# Altium project QCopterRC.PrjPCB
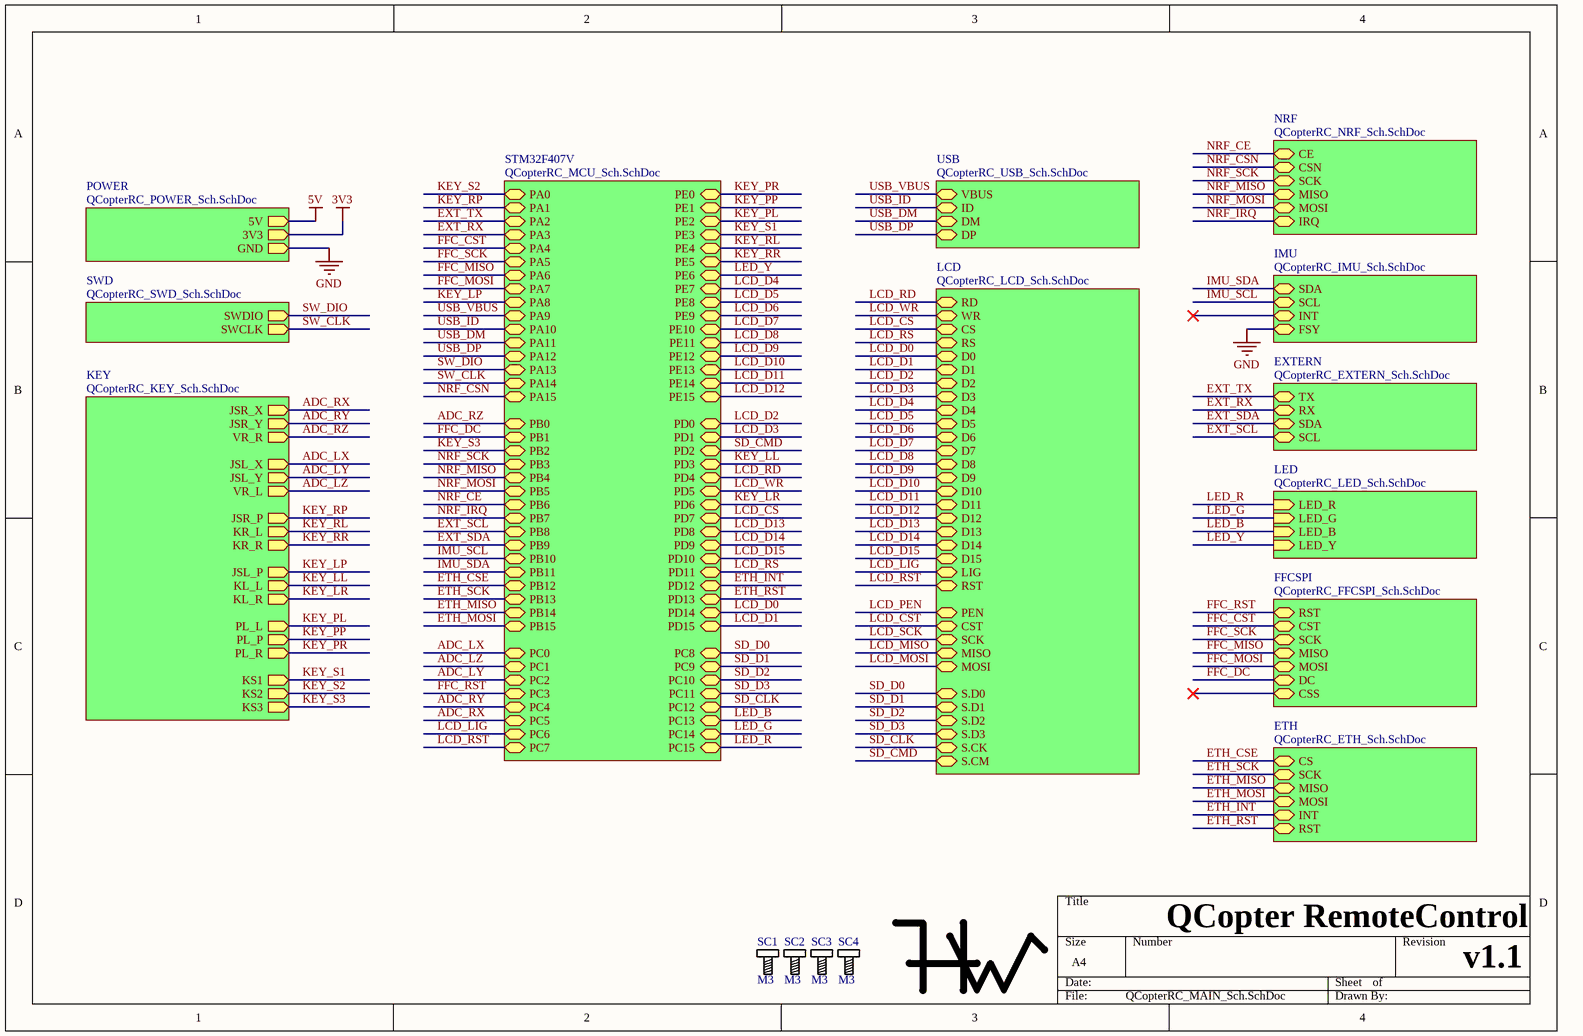
[diagram p0: QCopterRC_MAIN_Sch.SchDoc]
13 sheets, 122 parts. Net scope: hierarchical (ports join the sheet entries above them; power ports are global).
Board file: QCopterRC__Pcb.PcbDoc
Sheets:
  QCopterRC_MAIN_Sch.SchDoc
    POWER = QCopterRC_POWER_Sch.SchDoc
    SWD = QCopterRC_SWD_Sch.SchDoc
    LED = QCopterRC_LED_Sch.SchDoc
    STM32F407V = QCopterRC_MCU_Sch.SchDoc
    LCD = QCopterRC_LCD_Sch.SchDoc
    USB = QCopterRC_USB_Sch.SchDoc
    NRF = QCopterRC_NRF_Sch.SchDoc
    IMU = QCopterRC_IMU_Sch.SchDoc
    EXTERN = QCopterRC_EXTERN_Sch.SchDoc
    ETH = QCopterRC_ETH_Sch.SchDoc
    KEY = QCopterRC_KEY_Sch.SchDoc
    FFCSPI = QCopterRC_FFCSPI_Sch.SchDoc

## Sheet QCopterRC_MAIN_Sch.SchDoc
size A4

### Parts
HW  HW  [Logo_HW]  (value not drawn)
SC1  M3  [SCRREW_M3]
SC2  M3  [SCRREW_M3]
SC3  M3  [SCRREW_M3]
SC4  M3  [SCRREW_M3]

### Sub-sheets
ETH = QCopterRC_ETH_Sch.SchDoc: MISO, MOSI, SCK, CS, INT, RST
EXTERN = QCopterRC_EXTERN_Sch.SchDoc: SDA, SCL, TX, RX
FFCSPI = QCopterRC_FFCSPI_Sch.SchDoc: MISO, CST, MOSI, SCK, RST, DC, CSS
IMU = QCopterRC_IMU_Sch.SchDoc: SCL, SDA, FSY, INT
KEY = QCopterRC_KEY_Sch.SchDoc: JSR_Y (out), JSR_X (out), JSL_X (out), JSL_Y (out), VR_R (out), VR_L (out), KL_L (out), KL_R (out), KR_L (out), KR_R (out), JSL_P (out), PL_R (out), PL_L (out), JSR_P (out), KS1 (out), KS2 (out), KS3 (out), PL_P (out)
LCD = QCopterRC_LCD_Sch.SchDoc: RS, CS, WR, RD, RST, D0, D1, D2, D3, D4, D5, D6, D7, D8, D9, D10, D11, D12, D13, D14, D15, PEN, S.D0, S.CK, S.CM, S.D1, S.D2, S.D3, LIG, CST, SCK, MISO, MOSI
LED = QCopterRC_LED_Sch.SchDoc: LED_R (in), LED_G (in), LED_B (in), LED_Y (in)
NRF = QCopterRC_NRF_Sch.SchDoc: MISO, MOSI, SCK, CSN, CE, IRQ
POWER = QCopterRC_POWER_Sch.SchDoc: 3V3 (out), 5V (out), GND (out)
STM32F407V = QCopterRC_MCU_Sch.SchDoc: PA0, PA1, PA2, PA3, PA4, PA5, PA6, PA7, PA8, PA9, PA10, PA11, PA12, PA13, PA14, PA15, PB0, PB1, PB2, PB3, PB4, PB5, PB6, PB7, PB8, PB9, PB10, PB11, PB12, PB13, PB14, PB15, PC0, PC1, PC2, PC3, PC4, PC5, PC6, PC7, PC8, PC9, PC10, PC11, PC12, PC13, PC14, PC15, PD0, PD1, PD2, PD3, PD4, PD5, PD6, PD7, PD8, PD9, PD10, PD11, PD12, PD13, PD14, PD15, PE0, PE1, PE2, PE3, PE4, PE5, PE6, PE7, PE8, PE9, PE10, PE11, PE12, PE13, PE14, PE15
SWD = QCopterRC_SWD_Sch.SchDoc: SWDIO (out), SWCLK (out)
USB = QCopterRC_USB_Sch.SchDoc: VBUS, ID, DM, DP

### Nets
GND: sheet POWER/GND, sheet IMU/FSY
ADC_LX: sheet STM32F407V/PC0, sheet KEY/JSL_X
ADC_LY: sheet STM32F407V/PC2, sheet KEY/JSL_Y
ADC_LZ: sheet STM32F407V/PC1, sheet KEY/VR_L
ADC_RX: sheet STM32F407V/PC5, sheet KEY/JSR_X
ADC_RY: sheet STM32F407V/PC4, sheet KEY/JSR_Y
ADC_RZ: sheet STM32F407V/PB0, sheet KEY/VR_R
ETH_CSE: sheet STM32F407V/PB12, sheet ETH/CS
ETH_INT: sheet STM32F407V/PD12, sheet ETH/INT
ETH_MISO: sheet STM32F407V/PB14, sheet ETH/MISO
ETH_MOSI: sheet STM32F407V/PB15, sheet ETH/MOSI
ETH_RST: sheet STM32F407V/PD13, sheet ETH/RST
ETH_SCK: sheet STM32F407V/PB13, sheet ETH/SCK
EXT_RX: sheet STM32F407V/PA3, sheet EXTERN/RX
EXT_SCL: sheet STM32F407V/PB8, sheet EXTERN/SCL
EXT_SDA: sheet STM32F407V/PB9, sheet EXTERN/SDA
EXT_TX: sheet STM32F407V/PA2, sheet EXTERN/TX
FFC_CST: sheet STM32F407V/PA4, sheet FFCSPI/CST
FFC_DC: sheet STM32F407V/PB1, sheet FFCSPI/DC
FFC_MISO: sheet STM32F407V/PA6, sheet FFCSPI/MISO
FFC_MOSI: sheet STM32F407V/PA7, sheet FFCSPI/MOSI
FFC_RST: sheet STM32F407V/PC3, sheet FFCSPI/RST
FFC_SCK: sheet STM32F407V/PA5, sheet FFCSPI/SCK
IMU_SCL: sheet STM32F407V/PB10, sheet IMU/SCL
IMU_SDA: sheet STM32F407V/PB11, sheet IMU/SDA
KEY_LL: sheet STM32F407V/PD3, sheet KEY/KL_L
KEY_LP: sheet STM32F407V/PA8, sheet KEY/JSL_P
KEY_LR: sheet STM32F407V/PD6, sheet KEY/KL_R
KEY_PL: sheet STM32F407V/PE2, sheet KEY/PL_L
KEY_PP: sheet STM32F407V/PE1, sheet KEY/PL_P
KEY_PR: sheet STM32F407V/PE0, sheet KEY/PL_R
KEY_RL: sheet STM32F407V/PE4, sheet KEY/KR_L
KEY_RP: sheet STM32F407V/PA1, sheet KEY/JSR_P
KEY_RR: sheet STM32F407V/PE5, sheet KEY/KR_R
KEY_S1: sheet STM32F407V/PE3, sheet KEY/KS1
KEY_S2: sheet STM32F407V/PA0, sheet KEY/KS2
KEY_S3: sheet STM32F407V/PB2, sheet KEY/KS3
LCD_CS: sheet STM32F407V/PD7, sheet LCD/CS
LCD_CST: sheet LCD/CST
LCD_D0: sheet STM32F407V/PD14, sheet LCD/D0
LCD_D1: sheet STM32F407V/PD15, sheet LCD/D1
LCD_D2: sheet STM32F407V/PD0, sheet LCD/D2
LCD_D3: sheet STM32F407V/PD1, sheet LCD/D3
LCD_D4: sheet STM32F407V/PE7, sheet LCD/D4
LCD_D5: sheet STM32F407V/PE8, sheet LCD/D5
LCD_D6: sheet STM32F407V/PE9, sheet LCD/D6
LCD_D7: sheet STM32F407V/PE10, sheet LCD/D7
LCD_D8: sheet STM32F407V/PE11, sheet LCD/D8
LCD_D9: sheet STM32F407V/PE12, sheet LCD/D9
LCD_D10: sheet STM32F407V/PE13, sheet LCD/D10
LCD_D11: sheet STM32F407V/PE14, sheet LCD/D11
LCD_D12: sheet STM32F407V/PE15, sheet LCD/D12
LCD_D13: sheet STM32F407V/PD8, sheet LCD/D13
LCD_D14: sheet STM32F407V/PD9, sheet LCD/D14
LCD_D15: sheet STM32F407V/PD10, sheet LCD/D15
LCD_LIG: sheet STM32F407V/PC6, sheet LCD/LIG
LCD_MISO: sheet LCD/MISO
LCD_MOSI: sheet LCD/MOSI
LCD_PEN: sheet LCD/PEN
LCD_RD: sheet STM32F407V/PD4, sheet LCD/RD
LCD_RS: sheet STM32F407V/PD11, sheet LCD/RS
LCD_RST: sheet STM32F407V/PC7, sheet LCD/RST
LCD_SCK: sheet LCD/SCK
LCD_WR: sheet STM32F407V/PD5, sheet LCD/WR
LED_B: sheet LED/LED_B, sheet STM32F407V/PC13
LED_G: sheet LED/LED_G, sheet STM32F407V/PC14
LED_R: sheet LED/LED_R, sheet STM32F407V/PC15
LED_Y: sheet LED/LED_Y, sheet STM32F407V/PE6
NRF_CE: sheet STM32F407V/PB6, sheet NRF/CE
NRF_CSN: sheet STM32F407V/PA15, sheet NRF/CSN
NRF_IRQ: sheet STM32F407V/PB7, sheet NRF/IRQ
NRF_MISO: sheet STM32F407V/PB4, sheet NRF/MISO
NRF_MOSI: sheet STM32F407V/PB5, sheet NRF/MOSI
NRF_SCK: sheet STM32F407V/PB3, sheet NRF/SCK
SD_CLK: sheet STM32F407V/PC12, sheet LCD/S.CK
SD_CMD: sheet STM32F407V/PD2, sheet LCD/S.CM
SD_D0: sheet STM32F407V/PC8, sheet LCD/S.D0
SD_D1: sheet STM32F407V/PC9, sheet LCD/S.D1
SD_D2: sheet STM32F407V/PC10, sheet LCD/S.D2
SD_D3: sheet STM32F407V/PC11, sheet LCD/S.D3
SW_CLK: sheet SWD/SWCLK, sheet STM32F407V/PA14
SW_DIO: sheet SWD/SWDIO, sheet STM32F407V/PA13
USB_DM: sheet STM32F407V/PA11, sheet USB/DM
USB_DP: sheet STM32F407V/PA12, sheet USB/DP
USB_ID: sheet STM32F407V/PA10, sheet USB/ID
USB_VBUS: sheet STM32F407V/PA9, sheet USB/VBUS

### Notes on the sheet
- QCopter RemoteControl
- v1.1

### Library data of the parts
HW = HW: Logo
SC1-SC4 = Screw_M3: Screw

## Sheet QCopterRC_POWER_Sch.SchDoc
size A4
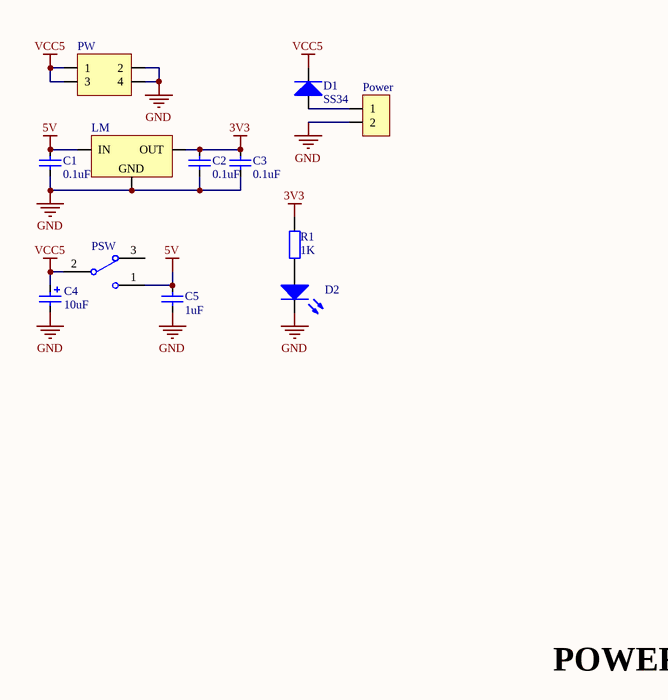
[diagram p1: QCopterRC_POWER_Sch.SchDoc]

### Parts
C1  value 0.1uF  [CAP_0603]  (hidden comment: Cap_0603)
C2  value 0.1uF  [CAP_0603]  (hidden comment: Cap_0603)
C3  value 0.1uF  [CAP_0603]  (hidden comment: Cap_0603)
C4  value 10uF  [CAP_TAN_B1210]  (hidden comment: Cap_Tan_1210)
C5  value 1uF  [CAP_0603]  (hidden comment: Cap_0603)
D1  SMA: SS34  [DO-214AC]  (hidden comment: Diode_SMA)
D2  LED_0603_WHITE  [LED_0603_WHITE]  (value not drawn)
LM  LM1117  [SOT223]  (value not drawn)
Power  HDR1X2_90_2.54  [HDR1X2_90_2.54]  (value not drawn)
PSW  SW_SPDT_4.3X8.6_D90  [SW_SPDT_4.3X8.6_D90]  (value not drawn)
PW  HDR2X2_90_2.54  [HDR2X2_90_2.54]  (value not drawn)
R1  value 1K  [RES_0603]  (hidden comment: Res_0603)

### Nets
3V3: C2.2 C3.2 LM.2(OUT) R1.2
5V: C1.1 C5.2 LM.3(IN) PSW.1
GND: C1.2 C2.1 C3.1 C4.2 C5.1 D2.2(K) LM.1(GND) Power.2 PW.2 PW.4
VCC5: C4.1 D1.2(K) PSW.2 PW.1 PW.3
NetD1_1: D1.1(A) Power.1
NetD2_1: D2.1(A) R1.1

Not connected (* = marked no-connect by the designer): PSW 3

### Notes on the sheet
- POWER

### Library data of the parts
C1-C3 C5 = Cap_0603: Capacitor
C4 = Cap_Tan_1210: Capacitor
D1 = Diode_SMA: Diode
D2 = LED_0603_WHITE: LED
LM = LM1117: Power
Power = HDR1X2_90_2.54: Header
PSW = SW_SPDT_4.3X8.6_D90: Switch
PW = HDR2X2_90_2.54: Header
R1 = Res_0603: Resistor

## Sheet QCopterRC_SWD_Sch.SchDoc
size A4
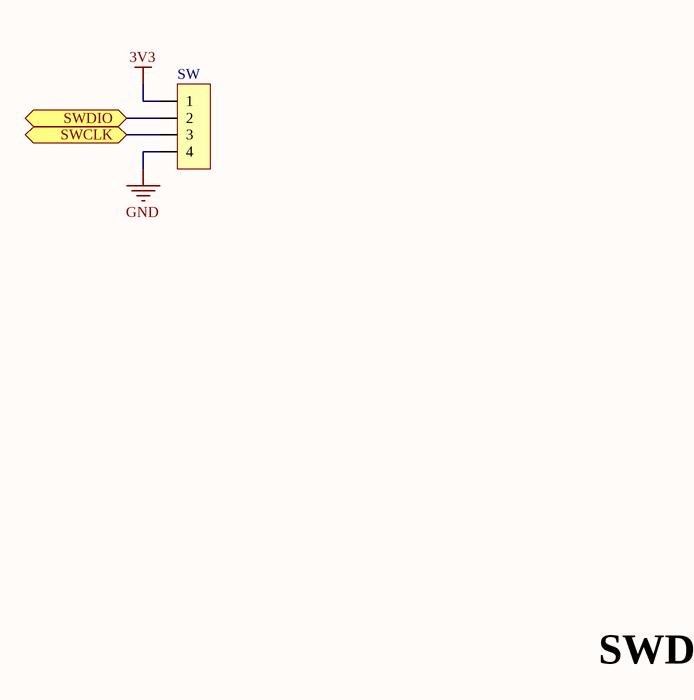
[diagram p2: QCopterRC_SWD_Sch.SchDoc]

### Parts
SW  HDR1X4_90F_2.54  [HDR1X4_90F_2.54]  (value not drawn)

### Ports
SWCLK, SWDIO

### Nets
3V3: SW.1
GND: SW.4
SW_CLK: SW.3 ; port SWCLK
SW_DIO: SW.2 ; port SWDIO

### Notes on the sheet
- SWD

### Library data of the parts
SW = HDR1X4_90F_2.54: Header

## Sheet QCopterRC_LED_Sch.SchDoc
size A4
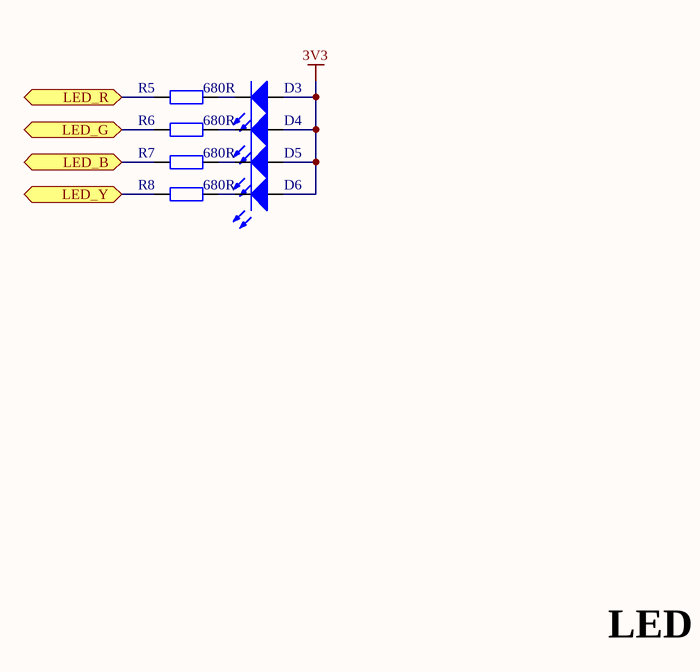
[diagram p3: QCopterRC_LED_Sch.SchDoc]

### Parts
D3  LED_0603_RED  [LED_0603_RED]  (value not drawn)
D4  LED_0603_GREEN  [LED_0603_GREEN]  (value not drawn)
D5  LED_0603_BLUE  [LED_0603_BLUE]  (value not drawn)
D6  LED_0603_YELLOW  [LED_0603_YELLOW]  (value not drawn)
R5  value 680R  [RES_0603]  (hidden comment: Res_0603)
R6  value 680R  [RES_0603]  (hidden comment: Res_0603)
R7  value 680R  [RES_0603]  (hidden comment: Res_0603)
R8  value 680R  [RES_0603]  (hidden comment: Res_0603)

### Ports
LED_B, LED_G, LED_R, LED_Y

### Nets
3V3: D3.1(A) D4.1(A) D5.1(A) D6.1(A)
LED_B: R7.1 ; port LED_B
LED_G: R6.1 ; port LED_G
LED_R: R5.1 ; port LED_R
LED_Y: R8.1 ; port LED_Y
NetD3_2: D3.2(K) R5.2
NetD4_2: D4.2(K) R6.2
NetD5_2: D5.2(K) R7.2
NetD6_2: D6.2(K) R8.2

### Notes on the sheet
- LED

### Library data of the parts
D3 = LED_0603_RED: LED
D4 = LED_0603_GREEN: LED
D5 = LED_0603_BLUE: LED
D6 = LED_0603_YELLOW: LED
R5-R8 = Res_0603: Resistor

## Sheet QCopterRC_MCU_Sch.SchDoc
size A4
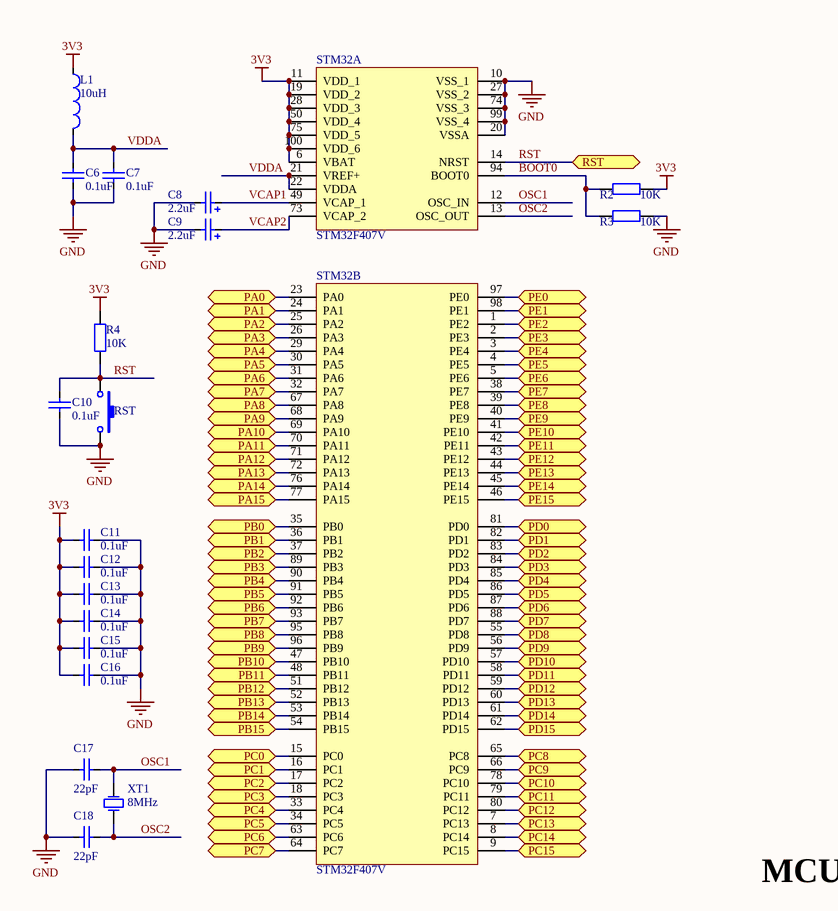
[diagram p4: QCopterRC_MCU_Sch.SchDoc]

### Parts
C6  value 0.1uF  [CAP_0603]  (hidden comment: Cap_0603)
C7  value 0.1uF  [CAP_0603]  (hidden comment: Cap_0603)
C8  value 2.2uF  [CAP_TAN_P0805]  (hidden comment: Cap_Tan_0805)
C9  value 2.2uF  [CAP_TAN_P0805]  (hidden comment: Cap_Tan_0805)
C10  value 0.1uF  [CAP_0603]  (hidden comment: Cap_0603)
C11  value 0.1uF  [CAP_0603]  (hidden comment: Cap_0603)
C12  value 0.1uF  [CAP_0603]  (hidden comment: Cap_0603)
C13  value 0.1uF  [CAP_0603]  (hidden comment: Cap_0603)
C14  value 0.1uF  [CAP_0603]  (hidden comment: Cap_0603)
C15  value 0.1uF  [CAP_0603]  (hidden comment: Cap_0603)
C16  value 0.1uF  [CAP_0603]  (hidden comment: Cap_0603)
C17  value 22pF  [CAP_0603]  (hidden comment: Cap_0603)
C18  value 22pF  [CAP_0603]  (hidden comment: Cap_0603)
L1  value 10uH  [IND_0603]  (hidden comment: Ind_0603)
R2  value 10K  [RES_0603]  (hidden comment: Res_0603)
R3  value 10K  [RES_0603]  (hidden comment: Res_0603)
R4  value 10K  [RES_0603]  (hidden comment: Res_0603)
RST  BT_TACT_3x6_180  [BT_TACT_3x6_180]  (value not drawn)
STM32  STM32F407V  [STM32F_100]  (parts A,B of 2)
XT1  value 8MHz  [XTAL_5032]  (hidden comment: XTAL_5032)

### Ports
PA0, PA1, PA2, PA3, PA4, PA5, PA6, PA7, PA8, PA9, PA10, PA11, PA12, PA13, PA14, PA15, PB0, PB1, PB2, PB3, PB4, PB5, PB6, PB7, PB8, PB9, PB10, PB11, PB12, PB13, PB14, PB15, PC0, PC1, PC2, PC3, PC4, PC5, PC6, PC7, PC8, PC9, PC10, PC11, PC12, PC13, PC14, PC15, PD0, PD1, PD2, PD3, PD4, PD5, PD6, PD7, PD8, PD9, PD10, PD11, PD12, PD13, PD14, PD15, PE0, PE1, PE2, PE3, PE4, PE5, PE6, PE7, PE8, PE9, PE10, PE11, PE12, PE13, PE14, PE15, RST

### Nets
3V3: C11.2 C12.2 C13.2 C14.2 C15.2 C16.2 L1.1 R2.2 R4.1 STM32.6(VBAT) STM32.11(VDD_1) STM32.19(VDD_2) STM32.28(VDD_3) STM32.50(VDD_4) STM32.75(VDD_5) STM32.100(VDD_6)
GND: C6.2 C7.2 C8.2 C9.2 C10.2 C11.1 C12.1 C13.1 C14.1 C15.1 C16.1 C17.1 C18.1 R3.2 RST.2 STM32.10(VSS_1) STM32.20(VSSA) STM32.27(VSS_2) STM32.74(VSS_3) STM32.99(VSS_4)
ADC_LX: STM32.15(PC0) ; port PC0
ADC_LY: STM32.17(PC2) ; port PC2
ADC_LZ: STM32.16(PC1) ; port PC1
ADC_RX: STM32.34(PC5) ; port PC5
ADC_RY: STM32.33(PC4) ; port PC4
ADC_RZ: STM32.35(PB0) ; port PB0
BOOT0: R2.1 R3.1 STM32.94(BOOT0)
ETH_CSE: STM32.51(PB12) ; port PB12
ETH_INT: STM32.59(PD12) ; port PD12
ETH_MISO: STM32.53(PB14) ; port PB14
ETH_MOSI: STM32.54(PB15) ; port PB15
ETH_RST: STM32.60(PD13) ; port PD13
ETH_SCK: STM32.52(PB13) ; port PB13
EXT_RX: STM32.26(PA3) ; port PA3
EXT_SCL: STM32.95(PB8) ; port PB8
EXT_SDA: STM32.96(PB9) ; port PB9
EXT_TX: STM32.25(PA2) ; port PA2
FFC_CST: STM32.29(PA4) ; port PA4
FFC_DC: STM32.36(PB1) ; port PB1
FFC_MISO: STM32.31(PA6) ; port PA6
FFC_MOSI: STM32.32(PA7) ; port PA7
FFC_RST: STM32.18(PC3) ; port PC3
FFC_SCK: STM32.30(PA5) ; port PA5
IMU_SCL: STM32.47(PB10) ; port PB10
IMU_SDA: STM32.48(PB11) ; port PB11
KEY_LL: STM32.84(PD3) ; port PD3
KEY_LP: STM32.67(PA8) ; port PA8
KEY_LR: STM32.87(PD6) ; port PD6
KEY_PL: STM32.1(PE2) ; port PE2
KEY_PP: STM32.98(PE1) ; port PE1
KEY_PR: STM32.97(PE0) ; port PE0
KEY_RL: STM32.3(PE4) ; port PE4
KEY_RP: STM32.24(PA1) ; port PA1
KEY_RR: STM32.4(PE5) ; port PE5
KEY_S1: STM32.2(PE3) ; port PE3
KEY_S2: STM32.23(PA0) ; port PA0
KEY_S3: STM32.37(PB2) ; port PB2
LCD_CS: STM32.88(PD7) ; port PD7
LCD_D0: STM32.61(PD14) ; port PD14
LCD_D1: STM32.62(PD15) ; port PD15
LCD_D2: STM32.81(PD0) ; port PD0
LCD_D3: STM32.82(PD1) ; port PD1
LCD_D4: STM32.38(PE7) ; port PE7
LCD_D5: STM32.39(PE8) ; port PE8
LCD_D6: STM32.40(PE9) ; port PE9
LCD_D7: STM32.41(PE10) ; port PE10
LCD_D8: STM32.42(PE11) ; port PE11
LCD_D9: STM32.43(PE12) ; port PE12
LCD_D10: STM32.44(PE13) ; port PE13
LCD_D11: STM32.45(PE14) ; port PE14
LCD_D12: STM32.46(PE15) ; port PE15
LCD_D13: STM32.55(PD8) ; port PD8
LCD_D14: STM32.56(PD9) ; port PD9
LCD_D15: STM32.57(PD10) ; port PD10
LCD_LIG: STM32.63(PC6) ; port PC6
LCD_RD: STM32.85(PD4) ; port PD4
LCD_RS: STM32.58(PD11) ; port PD11
LCD_RST: STM32.64(PC7) ; port PC7
LCD_WR: STM32.86(PD5) ; port PD5
LED_B: STM32.7(PC13) ; port PC13
LED_G: STM32.8(PC14) ; port PC14
LED_R: STM32.9(PC15) ; port PC15
LED_Y: STM32.5(PE6) ; port PE6
NRF_CE: STM32.92(PB6) ; port PB6
NRF_CSN: STM32.77(PA15) ; port PA15
NRF_IRQ: STM32.93(PB7) ; port PB7
NRF_MISO: STM32.90(PB4) ; port PB4
NRF_MOSI: STM32.91(PB5) ; port PB5
NRF_SCK: STM32.89(PB3) ; port PB3
OSC1: C17.2 STM32.12(OSC_IN) XT1.2(OSC2)
OSC2: C18.2 STM32.13(OSC_OUT) XT1.1(OSC1)
RST: C10.1 R4.2 RST.1 STM32.14(NRST) ; port RST
SD_CLK: STM32.80(PC12) ; port PC12
SD_CMD: STM32.83(PD2) ; port PD2
SD_D0: STM32.65(PC8) ; port PC8
SD_D1: STM32.66(PC9) ; port PC9
SD_D2: STM32.78(PC10) ; port PC10
SD_D3: STM32.79(PC11) ; port PC11
SW_CLK: STM32.76(PA14) ; port PA14
SW_DIO: STM32.72(PA13) ; port PA13
USB_DM: STM32.70(PA11) ; port PA11
USB_DP: STM32.71(PA12) ; port PA12
USB_ID: STM32.69(PA10) ; port PA10
USB_VBUS: STM32.68(PA9) ; port PA9
VCAP1: C8.1 STM32.49(VCAP_1)
VCAP2: C9.1 STM32.73(VCAP_2)
VDDA: C6.1 C7.1 L1.2 STM32.21(VREF+) STM32.22(VDDA)

### Notes on the sheet
- MCU

### Library data of the parts
C6 C7 C10-C18 = Cap_0603: Capacitor
C8 C9 = Cap_Tan_0805: Capacitor
L1 = Ind_0603: Inductor
R2-R4 = Res_0603: Resistor
RST = BT_TACT_3x6_180: Switch
STM32 = STM32F407V: MCU
XT1 = XTAL_5032: Crystal Oscillator; Published: 8-Jun-2000; LatestRevisionDate: 17-Jul-2002; LatestRevisionNote: Re-released for DXP Platform.; PackageReference: R38; Publisher: Altium Limited; PackageDescription: Crystal, Thru-Hole; 2 Leads; Body 3.1 x 8.2 mm (Dia.xH)

## Sheet QCopterRC_LCD_Sch.SchDoc
size A4; DocumentNumber: 10; SheetNumber: 10; SheetTotal: 10
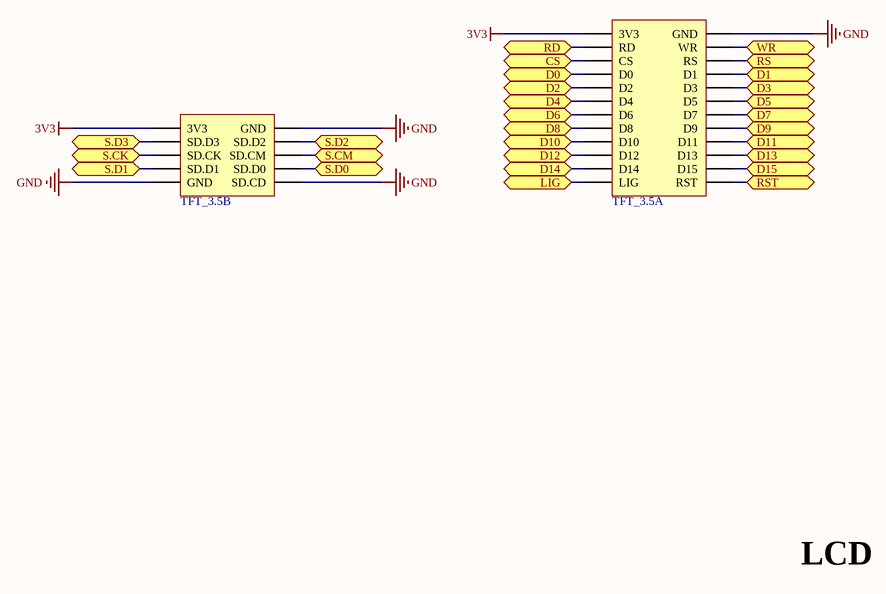
[diagram p5: QCopterRC_LCD_Sch.SchDoc]

### Parts
TFT_3.5  TFT_3.5  [TFT_3.5_480*320]  (value not drawn)  (parts A,B of 2)

### Ports
CS, D0, D1, D2, D3, D4, D5, D6, D7, D8, D9, D10, D11, D12, D13, D14, D15, LIG, RD, RS, RST, S.CK, S.CM, S.D0, S.D1, S.D2, S.D3, WR

### Nets
3V3: TFT_3.5.1(3V3) TFT_3.5.25(3V3)
GND: TFT_3.5.2(GND) TFT_3.5.26(GND) TFT_3.5.33(GND) TFT_3.5.34(SD.CD)
LCD_CS: TFT_3.5.5(CS) ; port CS
LCD_D0: TFT_3.5.7(D0) ; port D0
LCD_D1: TFT_3.5.8(D1) ; port D1
LCD_D2: TFT_3.5.9(D2) ; port D2
LCD_D3: TFT_3.5.10(D3) ; port D3
LCD_D4: TFT_3.5.11(D4) ; port D4
LCD_D5: TFT_3.5.12(D5) ; port D5
LCD_D6: TFT_3.5.13(D6) ; port D6
LCD_D7: TFT_3.5.14(D7) ; port D7
LCD_D8: TFT_3.5.15(D8) ; port D8
LCD_D9: TFT_3.5.16(D9) ; port D9
LCD_D10: TFT_3.5.17(D10) ; port D10
LCD_D11: TFT_3.5.18(D11) ; port D11
LCD_D12: TFT_3.5.19(D12) ; port D12
LCD_D13: TFT_3.5.20(D13) ; port D13
LCD_D14: TFT_3.5.21(D14) ; port D14
LCD_D15: TFT_3.5.22(D15) ; port D15
LCD_LIG: TFT_3.5.23(LIG) ; port LIG
LCD_RD: TFT_3.5.3(RD) ; port RD
LCD_RS: TFT_3.5.6(RS) ; port RS
LCD_RST: TFT_3.5.24(RST) ; port RST
LCD_WR: TFT_3.5.4(WR) ; port WR
SD_CLK: TFT_3.5.29(SD.CK) ; port S.CK
SD_CMD: TFT_3.5.30(SD.CM) ; port S.CM
SD_D0: TFT_3.5.32(SD.D0) ; port S.D0
SD_D1: TFT_3.5.31(SD.D1) ; port S.D1
SD_D2: TFT_3.5.28(SD.D2) ; port S.D2
SD_D3: TFT_3.5.27(SD.D3) ; port S.D3

### Notes on the sheet
- LCD

### Library data of the parts
TFT_3.5 = TFT_3.5_480*320: Module

## Sheet QCopterRC_USB_Sch.SchDoc
size A4
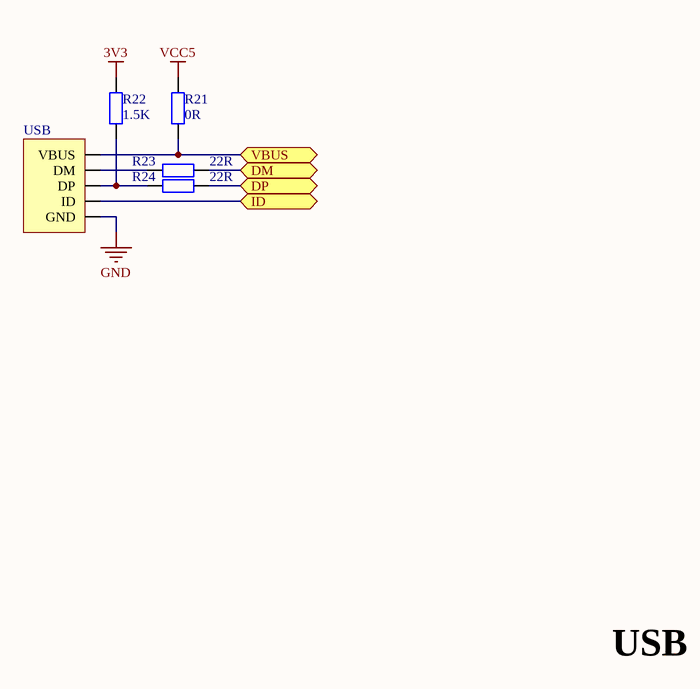
[diagram p6: QCopterRC_USB_Sch.SchDoc]

### Parts
R21  value 0R  [RES_0603]  (hidden comment: Res_0603)
R22  value 1.5K  [RES_0603]  (hidden comment: Res_0603)
R23  value 22R  [RES_0603]  (hidden comment: Res_0603)
R24  value 22R  [RES_0603]  (hidden comment: Res_0603)
USB  USB_Micro  [USB_MICRO_B]  (value not drawn)

### Ports
DM, DP, ID, VBUS

### Nets
3V3: R22.2
GND: USB.5(GND)
VCC5: R21.1
USB_DM: R23.2 ; port DM
USB_DP: R24.2 ; port DP
USB_ID: USB.4(ID) ; port ID
USB_VBUS: R21.2 USB.1(VBUS) ; port VBUS
NetR22_1: R22.1 R24.1 USB.3(DP)
NetR23_1: R23.1 USB.2(DM)

### Notes on the sheet
- USB

### Library data of the parts
R21-R24 = Res_0603: Resistor
USB = USB_Micro: USB

## Sheet QCopterRC_NRF_Sch.SchDoc
size A4
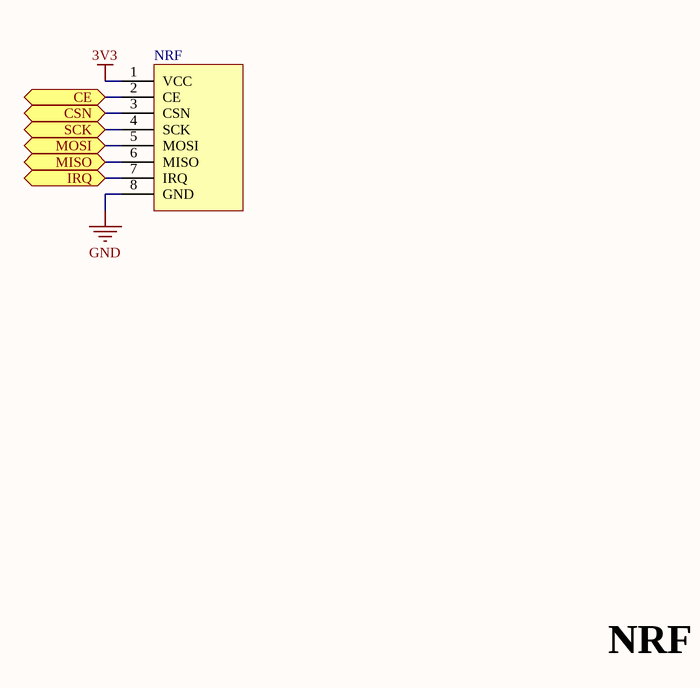
[diagram p7: QCopterRC_NRF_Sch.SchDoc]

### Parts
NRF  nRF24L01P_PA_LNA  [NRF24L01P_PA_LNA]  (value not drawn)

### Ports
CE, CSN, IRQ, MISO, MOSI, SCK

### Nets
3V3: NRF.1(VCC)
GND: NRF.8(GND)
NRF_CE: NRF.2(CE) ; port CE
NRF_CSN: NRF.3(CSN) ; port CSN
NRF_IRQ: NRF.7(IRQ) ; port IRQ
NRF_MISO: NRF.6(MISO) ; port MISO
NRF_MOSI: NRF.5(MOSI) ; port MOSI
NRF_SCK: NRF.4(SCK) ; port SCK

### Notes on the sheet
- NRF

### Library data of the parts
NRF = nRF24L01P_PA_LNA: Module

## Sheet QCopterRC_IMU_Sch.SchDoc
size A4
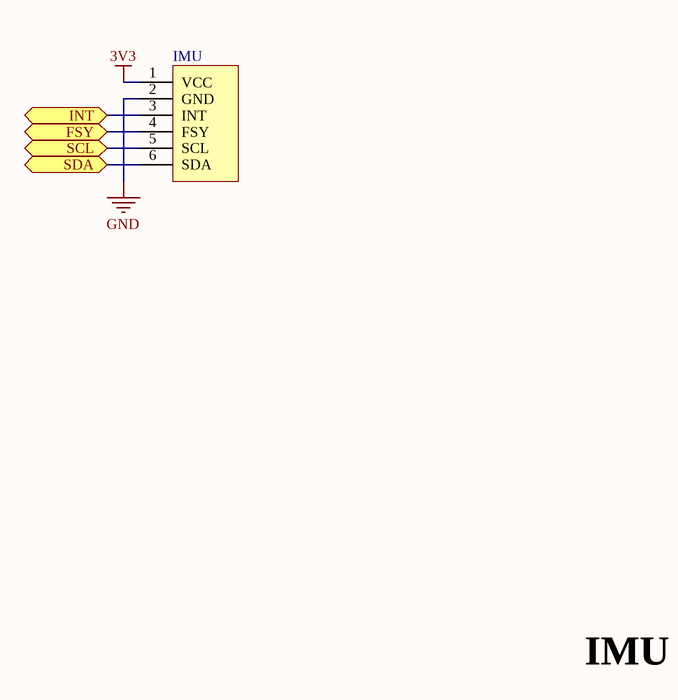
[diagram p8: QCopterRC_IMU_Sch.SchDoc]

### Parts
IMU  IMU_10-DOF  [IMU 10-DOF v1.1]  (value not drawn)

### Ports
FSY, INT, SCL, SDA

### Nets
3V3: IMU.1(VCC)
GND: IMU.2(GND) IMU.4(FSY) ; port FSY
IMU_SCL: IMU.5(SCL) ; port SCL
IMU_SDA: IMU.6(SDA) ; port SDA
NetIMU_3: IMU.3(INT) ; port INT

### Notes on the sheet
- IMU

### Library data of the parts
IMU = IMU 10 DOF: Module

## Sheet QCopterRC_EXTERN_Sch.SchDoc
size A4
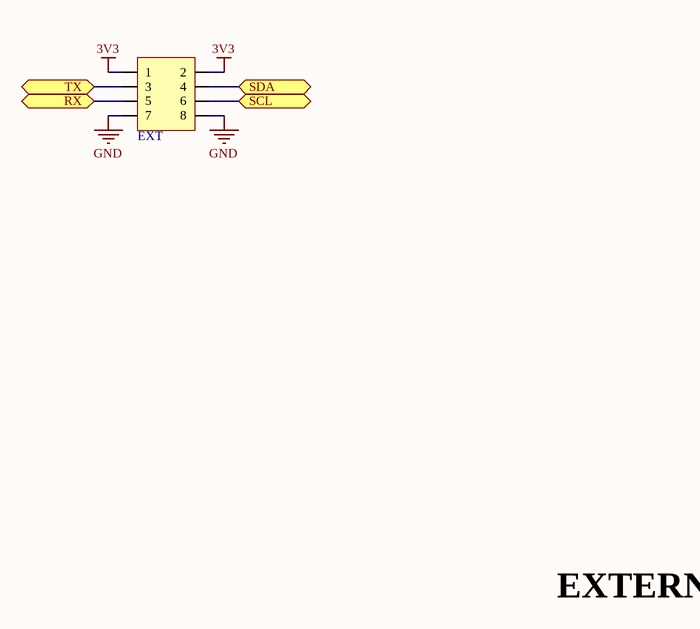
[diagram p9: QCopterRC_EXTERN_Sch.SchDoc]

### Parts
EXT  HDR2X4_90_2.54  [HDR2X4_90_2.54]  (value not drawn)

### Ports
RX, SCL, SDA, TX

### Nets
3V3: EXT.1 EXT.2
GND: EXT.7 EXT.8
EXT_RX: EXT.5 ; port RX
EXT_SCL: EXT.6 ; port SCL
EXT_SDA: EXT.4 ; port SDA
EXT_TX: EXT.3 ; port TX

### Notes on the sheet
- Labels drawn without touching a wire or pin: EXTERN

### Library data of the parts
EXT = HDR2X4_90_2.54: Header

## Sheet QCopterRC_ETH_Sch.SchDoc
size A4
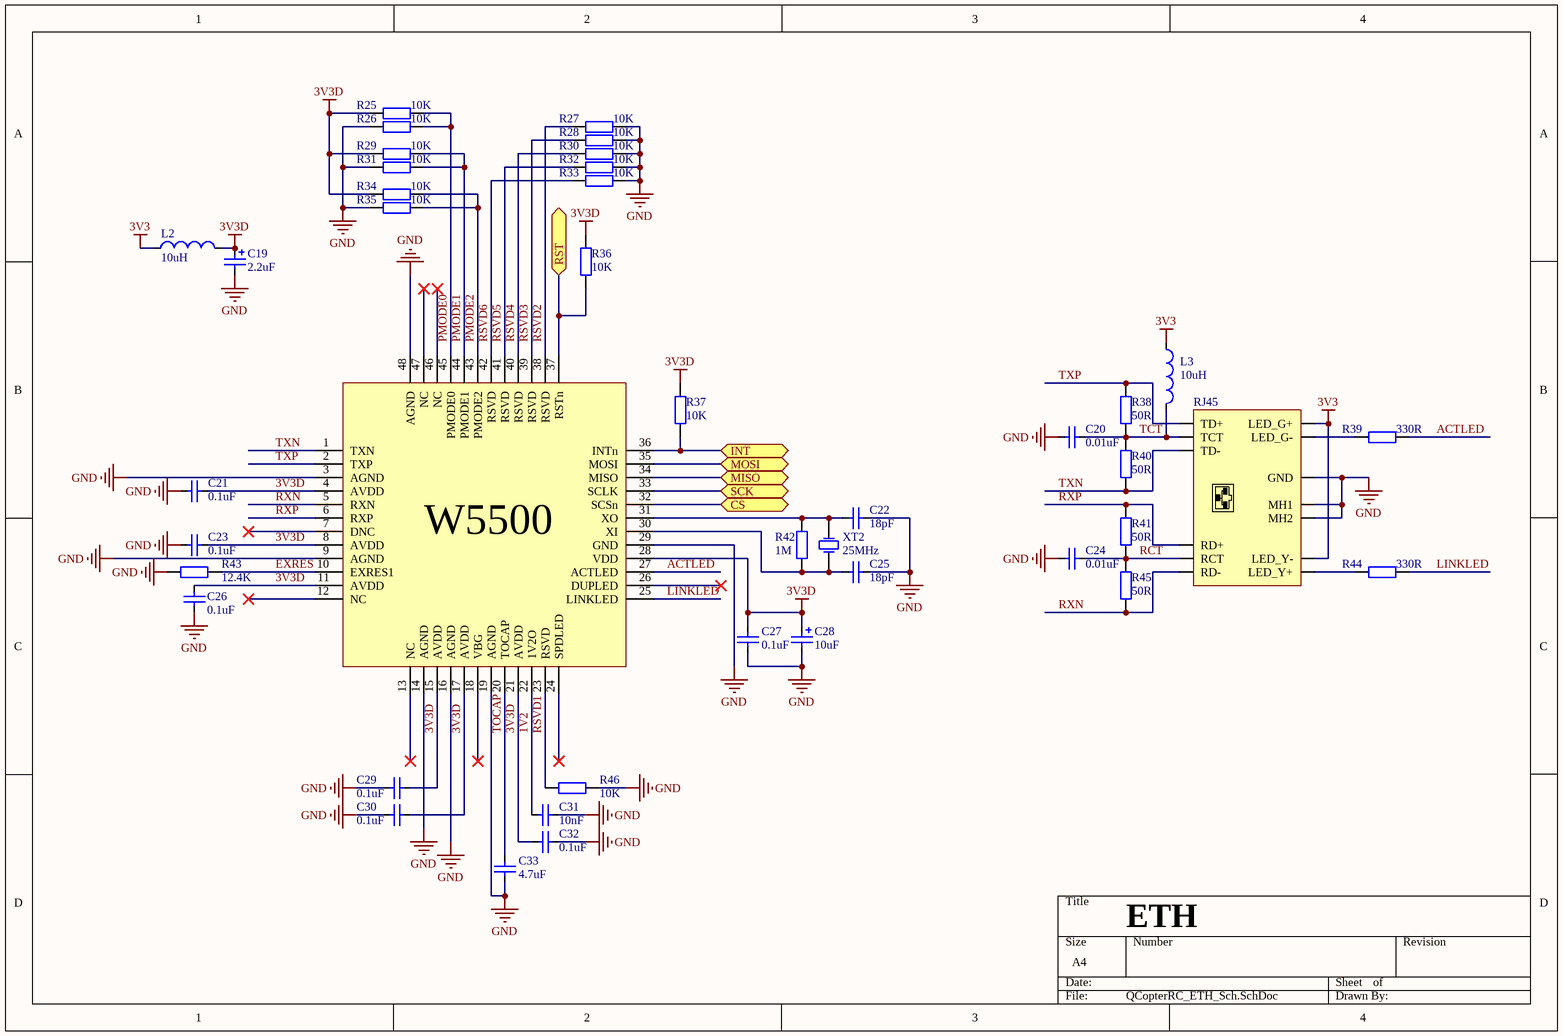
[diagram p10: QCopterRC_ETH_Sch.SchDoc]

### Parts
C19  value 2.2uF  [CAP_TAN_P0805]  (hidden comment: Cap_Tan_0805)
C20  value 0.01uF  [CAP_0603]  (hidden comment: Cap_0603)
C21  value 0.1uF  [CAP_0603]  (hidden comment: Cap_0603)
C22  value 18pF  [CAP_0603]  (hidden comment: Cap_0603)
C23  value 0.1uF  [CAP_0603]  (hidden comment: Cap_0603)
C24  value 0.01uF  [CAP_0603]  (hidden comment: Cap_0603)
C25  value 18pF  [CAP_0603]  (hidden comment: Cap_0603)
C26  value 0.1uF  [CAP_0603]  (hidden comment: Cap_0603)
C27  value 0.1uF  [CAP_0603]  (hidden comment: Cap_0603)
C28  value 10uF  [CAP_TAN_B1210]  (hidden comment: Cap_Tan_1210)
C29  value 0.1uF  [CAP_0603]  (hidden comment: Cap_0603)
C30  value 0.1uF  [CAP_0603]  (hidden comment: Cap_0603)
C31  value 10nF  [CAP_0603]  (hidden comment: Cap_0603)
C32  value 0.1uF  [CAP_0603]  (hidden comment: Cap_0603)
C33  value 4.7uF  [CAP_0603]  (hidden comment: Cap_0603)
L2  value 10uH  [IND_0603]  (hidden comment: Ind_0603)
L3  value 10uH  [IND_0603]  (hidden comment: Ind_0603)
R25  value 10K  [RES_0603]  (hidden comment: Res_0603)
R26  value 10K  [RES_0603]  (hidden comment: Res_0603)
R27  value 10K  [RES_0603]  (hidden comment: Res_0603)
R28  value 10K  [RES_0603]  (hidden comment: Res_0603)
R29  value 10K  [RES_0603]  (hidden comment: Res_0603)
R30  value 10K  [RES_0603]  (hidden comment: Res_0603)
R31  value 10K  [RES_0603]  (hidden comment: Res_0603)
R32  value 10K  [RES_0603]  (hidden comment: Res_0603)
R33  value 10K  [RES_0603]  (hidden comment: Res_0603)
R34  value 10K  [RES_0603]  (hidden comment: Res_0603)
R35  value 10K  [RES_0603]  (hidden comment: Res_0603)
R36  value 10K  [RES_0603]  (hidden comment: Res_0603)
R37  value 10K  [RES_0603]  (hidden comment: Res_0603)
R38  value 50R  [RES_0603]  (hidden comment: Res_0603)
R39  value 330R  [RES_0603]  (hidden comment: Res_0603)
R40  value 50R  [RES_0603]  (hidden comment: Res_0603)
R41  value 50R  [RES_0603]  (hidden comment: Res_0603)
R42  value 1M  [RES_0603]  (hidden comment: Res_0603)
R43  value 12.4K  [RES_0603]  (hidden comment: Res_0603)
R44  value 330R  [RES_0603]  (hidden comment: Res_0603)
R45  value 50R  [RES_0603]  (hidden comment: Res_0603)
R46  value 10K  [RES_0603]  (hidden comment: Res_0603)
RJ45  RJ45  [RJ-45_LED]  (value not drawn)
W5500  W5500  [W5500]  (value not drawn)
XT2  value 25MHz  [XTAL_5032]  (hidden comment: XTAL_5032)

### Ports
CS, INT, MISO, MOSI, RST, SCK

### Nets
3V3: L2.1 L3.1 RJ45.9(LED_G+) RJ45.11(LED_Y-)
3V3D: C19.1 C21.2 C23.2 C26.2 C27.2 C28.1 C29.1 C30.1 C32.2 L2.2 R25.2 R29.2 R34.2 R36.2 R37.2 W5500.4(AVDD) W5500.8(AVDD) W5500.11(AVDD) W5500.15(AVDD) W5500.17(AVDD) W5500.21(AVDD) W5500.28(VDD)
GND: C19.2 C20.1 C21.1 C22.1 C23.1 C24.1 C25.1 C26.1 C27.1 C28.2 C29.2 C30.2 C31.1 C32.1 C33.1 R26.2 R27.1 R28.1 R30.1 R31.2 R32.1 R33.1 R35.2 R43.2 R46.2 RJ45.8(GND) RJ45.13(MH1) RJ45.14(MH2) W5500.3(AGND) W5500.9(AGND) W5500.14(AGND) W5500.16(AGND) W5500.19(AGND) W5500.29(GND) W5500.48(AGND)
1V2: C31.2 W5500.22(1V2O)
ACTLED: R39.1 W5500.27(ACTLED)
ETH_CSE: W5500.32(SCSn) ; port CS
ETH_INT: R37.1 W5500.36(INTn) ; port INT
ETH_MISO: W5500.34(MISO) ; port MISO
ETH_MOSI: W5500.35(MOSI) ; port MOSI
ETH_RST: R36.1 W5500.37(RSTn) ; port RST
ETH_SCK: W5500.33(SCLK) ; port SCK
EXRES: R43.1 W5500.10(EXRES1)
LINKLED: R44.1 W5500.25(LINKLED)
PMODE0: R25.1 R26.1 W5500.45(PMODE0)
PMODE1: R29.1 R31.1 W5500.44(PMODE1)
PMODE2: R34.1 R35.1 W5500.43(PMODE2)
RCT: C24.2 R41.1 R45.2 RJ45.5(RCT)
RSVD1: R46.1 W5500.23(RSVD)
RSVD2: R27.2 W5500.38(RSVD)
RSVD3: R28.2 W5500.39(RSVD)
RSVD4: R30.2 W5500.40(RSVD)
RSVD5: R32.2 W5500.41(RSVD)
RSVD6: R33.2 W5500.42(RSVD)
RXN: R45.1 RJ45.6(RD-) W5500.5(RXN)
RXP: R41.2 RJ45.3(RD+) W5500.6(RXP)
TCT: C20.2 L3.2 R38.1 R40.2 RJ45.4(TCT)
TOCAP: C33.2 W5500.20(TOCAP)
TXN: R40.1 RJ45.2(TD-) W5500.1(TXN)
TXP: R38.2 RJ45.1(TD+) W5500.2(TXP)
NetC22_2: C22.2 R42.2 W5500.31(XO) XT2.2(OSC2)
NetC25_2: C25.2 R42.1 W5500.30(XI) XT2.1(OSC1)
NetR39_2: R39.2 RJ45.10(LED_G-)
NetR44_2: R44.2 RJ45.12(LED_Y+)

Not connected (* = marked no-connect by the designer): W5500 7(DNC)* 12(NC)* 13(NC)* 18(VBG)* 24(SPDLED)* 26(DUPLED)* 46(NC)* 47(NC)*

### Notes on the sheet
- Labels drawn without touching a wire or pin: ETH

### Library data of the parts
C19 = Cap_Tan_0805: Capacitor
C20-C27 C29-C33 = Cap_0603: Capacitor
C28 = Cap_Tan_1210: Capacitor
L2 L3 = Ind_0603: Inductor
R25-R46 = Res_0603: Resistor
RJ45 = RJ45: ETH
W5500 = W5500: Ethernet
XT2 = XTAL_5032: Crystal Oscillator; Published: 8-Jun-2000; LatestRevisionDate: 17-Jul-2002; LatestRevisionNote: Re-released for DXP Platform.; PackageReference: R38; Publisher: Altium Limited; PackageDescription: Crystal, Thru-Hole; 2 Leads; Body 3.1 x 8.2 mm (Dia.xH)

## Sheet QCopterRC_KEY_Sch.SchDoc
size A4
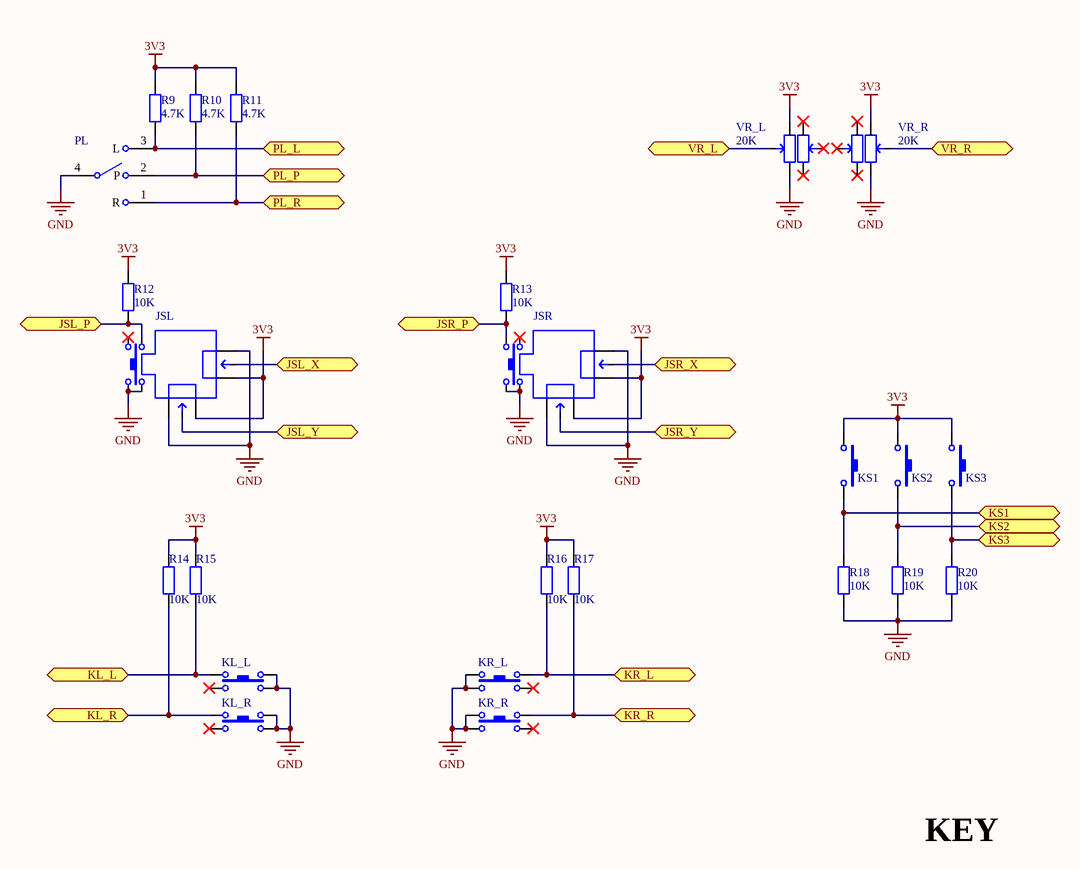
[diagram p11: QCopterRC_KEY_Sch.SchDoc]

### Parts
JSL  JoyStick  [JoyStick]  (value not drawn)
JSR  JoyStick  [JoyStick]  (value not drawn)
KL_L  BT_TACT_12X12_D180  [BT_TACT_12X12_D180]  (value not drawn)
KL_R  BT_TACT_12X12_D180  [BT_TACT_12X12_D180]  (value not drawn)
KR_L  BT_TACT_12X12_D180  [BT_TACT_12X12_D180]  (value not drawn)
KR_R  BT_TACT_12X12_D180  [BT_TACT_12X12_D180]  (value not drawn)
KS1  BT_TACT_3x6_180  [BT_TACT_3x6_180]  (value not drawn)
KS2  BT_TACT_3x6_180  [BT_TACT_3x6_180]  (value not drawn)
KS3  BT_TACT_3x6_180  [BT_TACT_3x6_180]  (value not drawn)
PL  BT_PushLever_11*12_90  [BT_PushLever_11*12_90]  (value not drawn)
R9  value 4.7K  [RES_0603]  (hidden comment: Res_0603)
R10  value 4.7K  [RES_0603]  (hidden comment: Res_0603)
R11  value 4.7K  [RES_0603]  (hidden comment: Res_0603)
R12  value 10K  [RES_0603]  (hidden comment: Res_0603)
R13  value 10K  [RES_0603]  (hidden comment: Res_0603)
R14  value 10K  [RES_0603]  (hidden comment: Res_0603)
R15  value 10K  [RES_0603]  (hidden comment: Res_0603)
R16  value 10K  [RES_0603]  (hidden comment: Res_0603)
R17  value 10K  [RES_0603]  (hidden comment: Res_0603)
R18  value 10K  [RES_0603]  (hidden comment: Res_0603)
R19  value 10K  [RES_0603]  (hidden comment: Res_0603)
R20  value 10K  [RES_0603]  (hidden comment: Res_0603)
VR_L  value 20K  [RES_45MM_DIP]  (hidden comment: RES_45MM_DIP)
VR_R  value 20K  [RES_45MM_DIP]  (hidden comment: RES_45MM_DIP)

### Ports
JSL_P, JSL_X, JSL_Y, JSR_P, JSR_X, JSR_Y, KL_L, KL_R, KR_L, KR_R, KS1, KS2, KS3, PL_L, PL_P, PL_R, VR_L, VR_R

### Nets
3V3: JSL.3 JSL.4 JSR.3 JSR.4 KS1.1 KS2.1 KS3.1 R9.1 R10.1 R11.1 R12.1 R13.1 R14.1 R15.1 R16.1 R17.1 VR_L.1(U) VR_R.3(U)
GND: JSL.1 JSL.6 JSL.8 JSL.10 JSR.1 JSR.6 JSR.8 JSR.10 KL_L.2 KL_L.4 KL_R.2 KL_R.4 KR_L.1 KR_L.3 KR_R.1 KR_R.3 PL.4 R18.2 R19.2 R20.2 VR_L.5(D) VR_R.6(D)
ADC_LX: JSL.5 ; port JSL_X
ADC_LY: JSL.2 ; port JSL_Y
ADC_LZ: VR_L.2(W) ; port VR_L
ADC_RX: JSR.5 ; port JSR_X
ADC_RY: JSR.2 ; port JSR_Y
ADC_RZ: VR_R.4(W) ; port VR_R
KEY_LL: KL_L.1 R15.2 ; port KL_L
KEY_LP: JSL.9 R12.2 ; port JSL_P
KEY_LR: KL_R.1 R14.2 ; port KL_R
KEY_PL: PL.3(L) R9.2 ; port PL_L
KEY_PP: PL.2(P) R10.2 ; port PL_P
KEY_PR: PL.1(R) R11.2 ; port PL_R
KEY_RL: KR_L.2 R16.2 ; port KR_L
KEY_RP: JSR.7 R13.2 ; port JSR_P
KEY_RR: KR_R.2 R17.2 ; port KR_R
KEY_S1: KS1.2 R18.1 ; port KS1
KEY_S2: KS2.2 R19.1 ; port KS2
KEY_S3: KS3.2 R20.1 ; port KS3

Not connected (* = marked no-connect by the designer): JSL 7*; JSR 9*; KL_L 3*; KL_R 3*; KR_L 4*; KR_R 4*; VR_L 3(U)* 4(W)* 6(D)*; VR_R 1(U)* 2(W)* 5(D)*

### Notes on the sheet
- KEY

### Library data of the parts
KL_L KL_R KR_L KR_R = BT_TACT_12X12_D180: Switch
KS1-KS3 = BT_TACT_3x6_180: Switch
PL = BT_PushLever_11*12_90: Switch
R9-R20 = Res_0603: Resistor
VR_L VR_R = RES_45MM_DIP: Resistor

## Sheet QCopterRC_FFCSPI_Sch.SchDoc
size A4
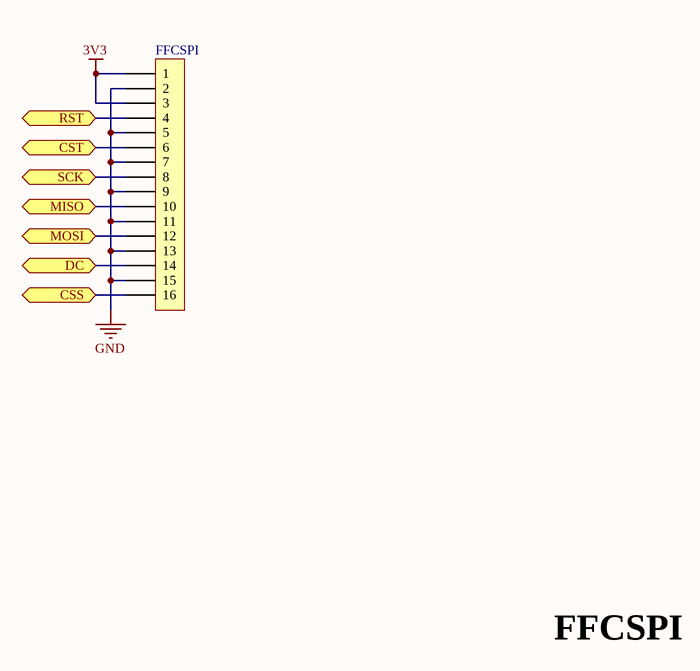
[diagram p12: QCopterRC_FFCSPI_Sch.SchDoc]

### Parts
FFCSPI  FFC_0.5_16  [FFC_0.5_16]  (value not drawn)

### Ports
CSS, CST, DC, MISO, MOSI, RST, SCK

### Nets
3V3: FFCSPI.1 FFCSPI.3
GND: FFCSPI.2 FFCSPI.5 FFCSPI.7 FFCSPI.9 FFCSPI.11 FFCSPI.13 FFCSPI.15
FFC_CST: FFCSPI.6 ; port CST
FFC_DC: FFCSPI.14 ; port DC
FFC_MISO: FFCSPI.10 ; port MISO
FFC_MOSI: FFCSPI.12 ; port MOSI
FFC_RST: FFCSPI.4 ; port RST
FFC_SCK: FFCSPI.8 ; port SCK
NetFFCSPI_16: FFCSPI.16 ; port CSS

### Notes on the sheet
- FFCSPI

### Library data of the parts
FFCSPI = FFC_0.5_16: FFC

## Nets that join several sheets
3V3: QCopterRC_POWER_Sch (C2.2 C3.2 LM.2 R1.2), QCopterRC_SWD_Sch (SW.1), QCopterRC_LED_Sch (D3.1 D4.1 D5.1 D6.1), QCopterRC_MCU_Sch (16 pins), QCopterRC_LCD_Sch (TFT_3.5.1 TFT_3.5.25), QCopterRC_USB_Sch (R22.2), QCopterRC_NRF_Sch (NRF.1), QCopterRC_IMU_Sch (IMU.1), QCopterRC_EXTERN_Sch (EXT.1 EXT.2), QCopterRC_ETH_Sch (L2.1 L3.1 RJ45.9 RJ45.11), QCopterRC_KEY_Sch (18 pins), QCopterRC_FFCSPI_Sch (FFCSPI.1 FFCSPI.3)
GND: QCopterRC_POWER_Sch (10 pins), QCopterRC_SWD_Sch (SW.4), QCopterRC_MCU_Sch (20 pins), QCopterRC_LCD_Sch (TFT_3.5.2 TFT_3.5.26 TFT_3.5.33 TFT_3.5.34), QCopterRC_USB_Sch (USB.5), QCopterRC_NRF_Sch (NRF.8), QCopterRC_IMU_Sch (IMU.2 IMU.4), QCopterRC_EXTERN_Sch (EXT.7 EXT.8), QCopterRC_ETH_Sch (35 pins), QCopterRC_KEY_Sch (22 pins), QCopterRC_FFCSPI_Sch (7 pins)
VCC5: QCopterRC_POWER_Sch (5 pins), QCopterRC_USB_Sch (R21.1)
ADC_LX: QCopterRC_MCU_Sch (STM32.15), QCopterRC_KEY_Sch (JSL.5)
ADC_LY: QCopterRC_MCU_Sch (STM32.17), QCopterRC_KEY_Sch (JSL.2)
ADC_LZ: QCopterRC_MCU_Sch (STM32.16), QCopterRC_KEY_Sch (VR_L.2)
ADC_RX: QCopterRC_MCU_Sch (STM32.34), QCopterRC_KEY_Sch (JSR.5)
ADC_RY: QCopterRC_MCU_Sch (STM32.33), QCopterRC_KEY_Sch (JSR.2)
ADC_RZ: QCopterRC_MCU_Sch (STM32.35), QCopterRC_KEY_Sch (VR_R.4)
ETH_CSE: QCopterRC_MCU_Sch (STM32.51), QCopterRC_ETH_Sch (W5500.32)
ETH_INT: QCopterRC_MCU_Sch (STM32.59), QCopterRC_ETH_Sch (R37.1 W5500.36)
ETH_MISO: QCopterRC_MCU_Sch (STM32.53), QCopterRC_ETH_Sch (W5500.34)
ETH_MOSI: QCopterRC_MCU_Sch (STM32.54), QCopterRC_ETH_Sch (W5500.35)
ETH_RST: QCopterRC_MCU_Sch (STM32.60), QCopterRC_ETH_Sch (R36.1 W5500.37)
ETH_SCK: QCopterRC_MCU_Sch (STM32.52), QCopterRC_ETH_Sch (W5500.33)
EXT_RX: QCopterRC_MCU_Sch (STM32.26), QCopterRC_EXTERN_Sch (EXT.5)
EXT_SCL: QCopterRC_MCU_Sch (STM32.95), QCopterRC_EXTERN_Sch (EXT.6)
EXT_SDA: QCopterRC_MCU_Sch (STM32.96), QCopterRC_EXTERN_Sch (EXT.4)
EXT_TX: QCopterRC_MCU_Sch (STM32.25), QCopterRC_EXTERN_Sch (EXT.3)
FFC_CST: QCopterRC_MCU_Sch (STM32.29), QCopterRC_FFCSPI_Sch (FFCSPI.6)
FFC_DC: QCopterRC_MCU_Sch (STM32.36), QCopterRC_FFCSPI_Sch (FFCSPI.14)
FFC_MISO: QCopterRC_MCU_Sch (STM32.31), QCopterRC_FFCSPI_Sch (FFCSPI.10)
FFC_MOSI: QCopterRC_MCU_Sch (STM32.32), QCopterRC_FFCSPI_Sch (FFCSPI.12)
FFC_RST: QCopterRC_MCU_Sch (STM32.18), QCopterRC_FFCSPI_Sch (FFCSPI.4)
FFC_SCK: QCopterRC_MCU_Sch (STM32.30), QCopterRC_FFCSPI_Sch (FFCSPI.8)
IMU_SCL: QCopterRC_MCU_Sch (STM32.47), QCopterRC_IMU_Sch (IMU.5)
IMU_SDA: QCopterRC_MCU_Sch (STM32.48), QCopterRC_IMU_Sch (IMU.6)
KEY_LL: QCopterRC_MCU_Sch (STM32.84), QCopterRC_KEY_Sch (KL_L.1 R15.2)
KEY_LP: QCopterRC_MCU_Sch (STM32.67), QCopterRC_KEY_Sch (JSL.9 R12.2)
KEY_LR: QCopterRC_MCU_Sch (STM32.87), QCopterRC_KEY_Sch (KL_R.1 R14.2)
KEY_PL: QCopterRC_MCU_Sch (STM32.1), QCopterRC_KEY_Sch (PL.3 R9.2)
KEY_PP: QCopterRC_MCU_Sch (STM32.98), QCopterRC_KEY_Sch (PL.2 R10.2)
KEY_PR: QCopterRC_MCU_Sch (STM32.97), QCopterRC_KEY_Sch (PL.1 R11.2)
KEY_RL: QCopterRC_MCU_Sch (STM32.3), QCopterRC_KEY_Sch (KR_L.2 R16.2)
KEY_RP: QCopterRC_MCU_Sch (STM32.24), QCopterRC_KEY_Sch (JSR.7 R13.2)
KEY_RR: QCopterRC_MCU_Sch (STM32.4), QCopterRC_KEY_Sch (KR_R.2 R17.2)
KEY_S1: QCopterRC_MCU_Sch (STM32.2), QCopterRC_KEY_Sch (KS1.2 R18.1)
KEY_S2: QCopterRC_MCU_Sch (STM32.23), QCopterRC_KEY_Sch (KS2.2 R19.1)
KEY_S3: QCopterRC_MCU_Sch (STM32.37), QCopterRC_KEY_Sch (KS3.2 R20.1)
LCD_CS: QCopterRC_MCU_Sch (STM32.88), QCopterRC_LCD_Sch (TFT_3.5.5)
LCD_D0: QCopterRC_MCU_Sch (STM32.61), QCopterRC_LCD_Sch (TFT_3.5.7)
LCD_D1: QCopterRC_MCU_Sch (STM32.62), QCopterRC_LCD_Sch (TFT_3.5.8)
LCD_D2: QCopterRC_MCU_Sch (STM32.81), QCopterRC_LCD_Sch (TFT_3.5.9)
LCD_D3: QCopterRC_MCU_Sch (STM32.82), QCopterRC_LCD_Sch (TFT_3.5.10)
LCD_D4: QCopterRC_MCU_Sch (STM32.38), QCopterRC_LCD_Sch (TFT_3.5.11)
LCD_D5: QCopterRC_MCU_Sch (STM32.39), QCopterRC_LCD_Sch (TFT_3.5.12)
LCD_D6: QCopterRC_MCU_Sch (STM32.40), QCopterRC_LCD_Sch (TFT_3.5.13)
LCD_D7: QCopterRC_MCU_Sch (STM32.41), QCopterRC_LCD_Sch (TFT_3.5.14)
LCD_D8: QCopterRC_MCU_Sch (STM32.42), QCopterRC_LCD_Sch (TFT_3.5.15)
LCD_D9: QCopterRC_MCU_Sch (STM32.43), QCopterRC_LCD_Sch (TFT_3.5.16)
LCD_D10: QCopterRC_MCU_Sch (STM32.44), QCopterRC_LCD_Sch (TFT_3.5.17)
LCD_D11: QCopterRC_MCU_Sch (STM32.45), QCopterRC_LCD_Sch (TFT_3.5.18)
LCD_D12: QCopterRC_MCU_Sch (STM32.46), QCopterRC_LCD_Sch (TFT_3.5.19)
LCD_D13: QCopterRC_MCU_Sch (STM32.55), QCopterRC_LCD_Sch (TFT_3.5.20)
LCD_D14: QCopterRC_MCU_Sch (STM32.56), QCopterRC_LCD_Sch (TFT_3.5.21)
LCD_D15: QCopterRC_MCU_Sch (STM32.57), QCopterRC_LCD_Sch (TFT_3.5.22)
LCD_LIG: QCopterRC_MCU_Sch (STM32.63), QCopterRC_LCD_Sch (TFT_3.5.23)
LCD_RD: QCopterRC_MCU_Sch (STM32.85), QCopterRC_LCD_Sch (TFT_3.5.3)
LCD_RS: QCopterRC_MCU_Sch (STM32.58), QCopterRC_LCD_Sch (TFT_3.5.6)
LCD_RST: QCopterRC_MCU_Sch (STM32.64), QCopterRC_LCD_Sch (TFT_3.5.24)
LCD_WR: QCopterRC_MCU_Sch (STM32.86), QCopterRC_LCD_Sch (TFT_3.5.4)
LED_B: QCopterRC_LED_Sch (R7.1), QCopterRC_MCU_Sch (STM32.7)
LED_G: QCopterRC_LED_Sch (R6.1), QCopterRC_MCU_Sch (STM32.8)
LED_R: QCopterRC_LED_Sch (R5.1), QCopterRC_MCU_Sch (STM32.9)
LED_Y: QCopterRC_LED_Sch (R8.1), QCopterRC_MCU_Sch (STM32.5)
NRF_CE: QCopterRC_MCU_Sch (STM32.92), QCopterRC_NRF_Sch (NRF.2)
NRF_CSN: QCopterRC_MCU_Sch (STM32.77), QCopterRC_NRF_Sch (NRF.3)
NRF_IRQ: QCopterRC_MCU_Sch (STM32.93), QCopterRC_NRF_Sch (NRF.7)
NRF_MISO: QCopterRC_MCU_Sch (STM32.90), QCopterRC_NRF_Sch (NRF.6)
NRF_MOSI: QCopterRC_MCU_Sch (STM32.91), QCopterRC_NRF_Sch (NRF.5)
NRF_SCK: QCopterRC_MCU_Sch (STM32.89), QCopterRC_NRF_Sch (NRF.4)
SD_CLK: QCopterRC_MCU_Sch (STM32.80), QCopterRC_LCD_Sch (TFT_3.5.29)
SD_CMD: QCopterRC_MCU_Sch (STM32.83), QCopterRC_LCD_Sch (TFT_3.5.30)
SD_D0: QCopterRC_MCU_Sch (STM32.65), QCopterRC_LCD_Sch (TFT_3.5.32)
SD_D1: QCopterRC_MCU_Sch (STM32.66), QCopterRC_LCD_Sch (TFT_3.5.31)
SD_D2: QCopterRC_MCU_Sch (STM32.78), QCopterRC_LCD_Sch (TFT_3.5.28)
SD_D3: QCopterRC_MCU_Sch (STM32.79), QCopterRC_LCD_Sch (TFT_3.5.27)
SW_CLK: QCopterRC_SWD_Sch (SW.3), QCopterRC_MCU_Sch (STM32.76)
SW_DIO: QCopterRC_SWD_Sch (SW.2), QCopterRC_MCU_Sch (STM32.72)
USB_DM: QCopterRC_MCU_Sch (STM32.70), QCopterRC_USB_Sch (R23.2)
USB_DP: QCopterRC_MCU_Sch (STM32.71), QCopterRC_USB_Sch (R24.2)
USB_ID: QCopterRC_MCU_Sch (STM32.69), QCopterRC_USB_Sch (USB.4)
USB_VBUS: QCopterRC_MCU_Sch (STM32.68), QCopterRC_USB_Sch (R21.2 USB.1)